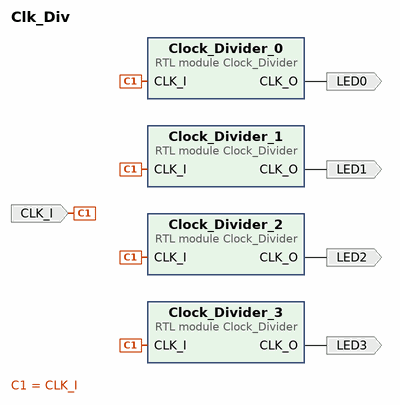
[diagram p0: block diagram of the top level]
# Vivado block design Clk_Div, xc7z020clg400-1, Vivado 2022.2
create_bd_design Clk_Div

create_bd_port -dir I -type clk CLK_I
set_property -dict {CONFIG.FREQ_HZ 125000000} [get_bd_ports CLK_I]
create_bd_port -dir O LED0
create_bd_port -dir O LED1
create_bd_port -dir O LED2
create_bd_port -dir O LED3

create_bd_cell -type module -reference Clock_Divider Clock_Divider_0
set_property -dict {CONFIG.DIVISOR 0x7735940} [get_bd_cells Clock_Divider_0]
create_bd_cell -type module -reference Clock_Divider Clock_Divider_1
set_property -dict {CONFIG.DIVISOR 0x389ACA0} [get_bd_cells Clock_Divider_1]
create_bd_cell -type module -reference Clock_Divider Clock_Divider_2
set_property -dict {CONFIG.DIVISOR 0x1DCD650} [get_bd_cells Clock_Divider_2]
create_bd_cell -type module -reference Clock_Divider Clock_Divider_3
set_property -dict {CONFIG.DIVISOR 0x0EE6828} [get_bd_cells Clock_Divider_3]

# ---- connections ----

connect_bd_net [get_bd_ports CLK_I] \
  [get_bd_pins Clock_Divider_2/CLK_I] [get_bd_pins Clock_Divider_1/CLK_I] [get_bd_pins Clock_Divider_0/CLK_I] \
  [get_bd_pins Clock_Divider_3/CLK_I]
connect_bd_net [get_bd_pins Clock_Divider_0/CLK_O] [get_bd_ports LED0]
connect_bd_net [get_bd_pins Clock_Divider_1/CLK_O] [get_bd_ports LED1]
connect_bd_net [get_bd_pins Clock_Divider_2/CLK_O] [get_bd_ports LED2]
connect_bd_net [get_bd_pins Clock_Divider_3/CLK_O] [get_bd_ports LED3]

validate_bd_design
save_bd_design
